# Altium schematic sheet Power-Supply.SchDoc: Power Supply
size A4; Revision: 1.0
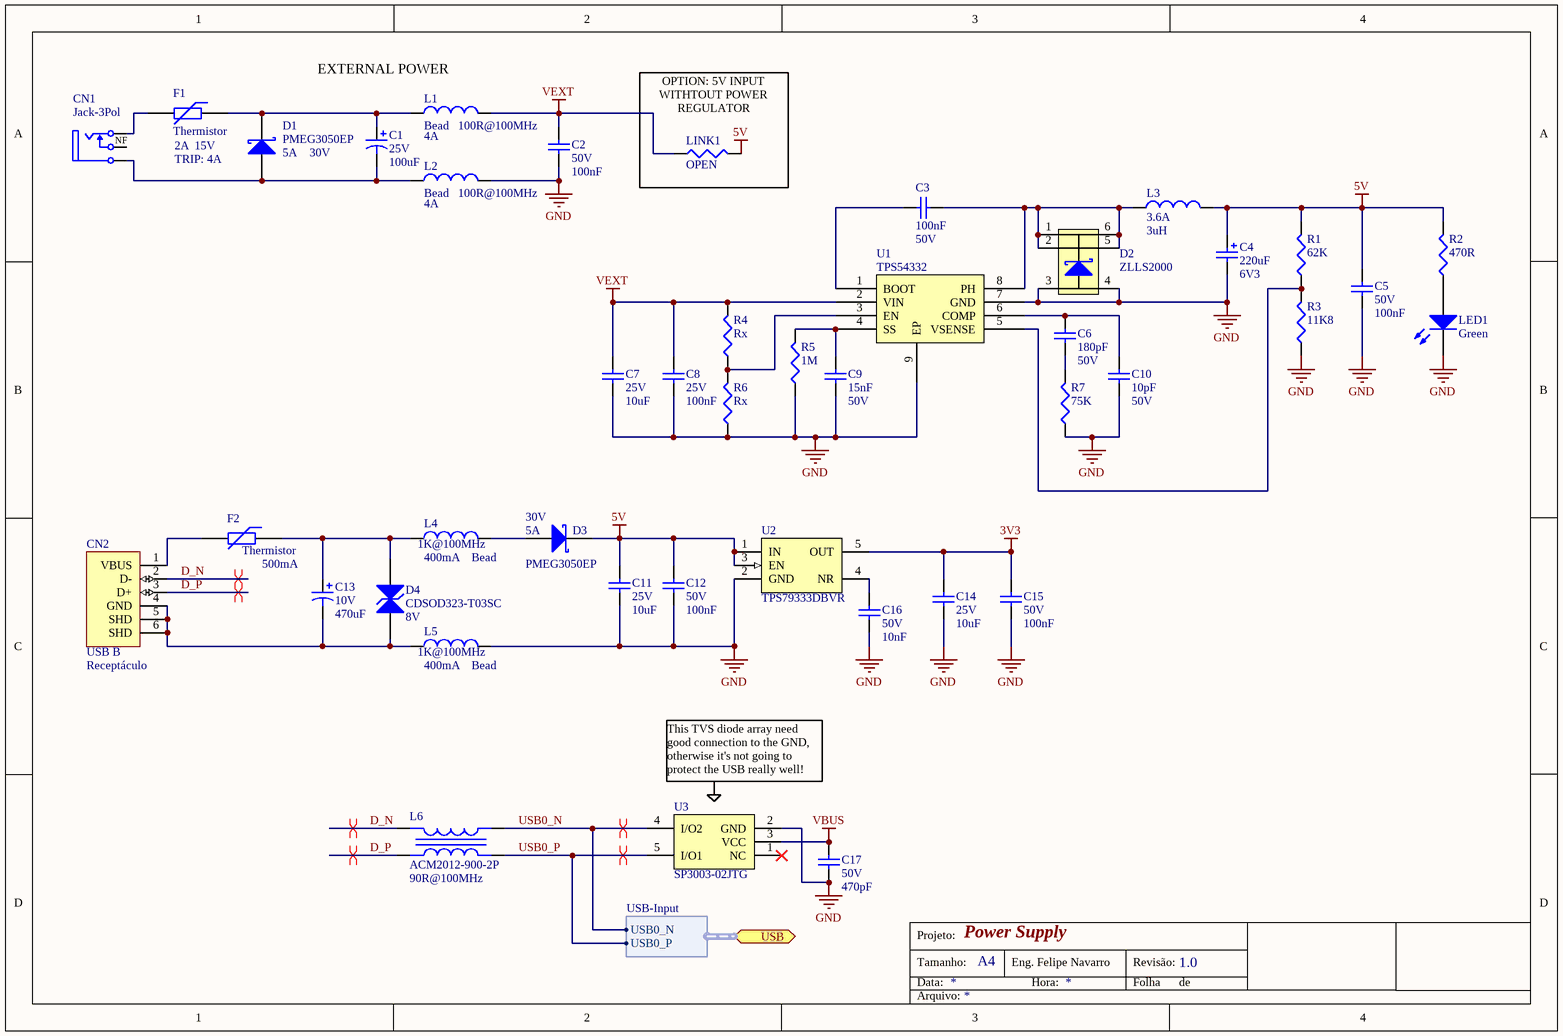
[diagram p0: Power-Supply.SchDoc]

## Parts
C1  value 100uF  Tensão: 25V  [CPOLRAD8X14]  (hidden comment: Capacitor Eletrolítico)
C2  value 100nF  Tensão: 50V  [CC0603]  (hidden comment: Capacitor Cerâmico)
C3  value 100nF  Tensão: 50V  [CC0603]  (hidden comment: Capacitor Cerâmico)
C4  value 220uF  Tensão: 6V3  [CPOL2917]  (hidden comment: Capacitor Tântalo)
C5  value 100nF  Tensão: 50V  [CC0603]  (hidden comment: Capacitor Cerâmico)
C6  value 180pF  Tensão: 50V  [CC0603]  (hidden comment: Capacitor Cerâmico)
C7  value 10uF  Tensão: 25V  [CC0805]  (hidden comment: Capacitor Cerâmico)
C8  value 100nF  Tensão: 25V  [CC0603]  (hidden comment: Capacitor Cerâmico)
C9  value 15nF  Tensão: 50V  [CC0603]  (hidden comment: Capacitor Cerâmico)
C10  value 10pF  Tensão: 50V  [CC0603]  (hidden comment: Capacitor Cerâmico)
C11  value 10uF  Tensão: 25V  [CC0805]  (hidden comment: Capacitor Cerâmico)
C12  value 100nF  Tensão: 50V  [CC0603]  (hidden comment: Capacitor Cerâmico)
C13  value 470uF  Tensão: 10V  [CPOLRAD6X12]  (hidden comment: Capacitor Eletrolítico)
C14  value 10uF  Tensão: 25V  [CC0805]  (hidden comment: Capacitor Cerâmico)
C15  value 100nF  Tensão: 50V  [CC0603]  (hidden comment: Capacitor Cerâmico)
C16  value 10nF  Tensão: 50V  [CC0603]  (hidden comment: Capacitor Cerâmico)
C17  value 470pF  Tensão: 50V  [CC0603]  (hidden comment: Capacitor Cerâmico)
CN1  Jack-3Pol  [CONN_JACK-FONTE_3N]
CN2  USB B  value Receptáculo  [CONN_USB-B_RCPT-H]
D1  PMEG3050EP  Corrente: 5A  Tensão: 30V  [SOD-128]
D2  ZLLS2000  [SOT-23-6N]
D3  PMEG3050EP  Corrente: 5A  Tensão: 30V  [SOD-128]
D4  CDSOD323-T03SC  Tensão: 8V  [SOD-323 BIDIRECT]
F1  Thermistor  Corrente: 2A  Tensão: 15V  Obs: TRIP: 4A  [CC1210]
F2  Thermistor  Corrente: 500mA  [CC1812]
L1  Bead  value 100R@100MHz  Corrente: 4A  [CC0805]
L2  Bead  value 100R@100MHz  Corrente: 4A  [CC0805]
L3  value 3uH  Corrente: 3.6A  [NR2424]  (hidden comment: Indutor)
L4  Bead  value 1K@100MHz  Corrente: 400mA  [CC0603]
L5  Bead  value 1K@100MHz  Corrente: 400mA  [CC0603]
L6  ACM2012-900-2P  value 90R@100MHz  [TR0805-4N]
LED1  value Green  [LED-INDIC]  (hidden comment: LED)
LINK1  value OPEN  [CC1210]  (hidden comment: Resistor Open)  (no BOM)
R1  value 62K  [CC0603]  (hidden comment: Resistor)
R2  value 470R  [CC0603]  (hidden comment: Resistor)
R3  value 11K8  [CC0603]  (hidden comment: Resistor)
R4  value Rx  [CC0603]  (hidden comment: Resistor)
R5  value 1M  [CC0603]  (hidden comment: Resistor)
R6  value Rx  [CC0603]  (hidden comment: Resistor)
R7  value 75K  [CC0603]  (hidden comment: Resistor)
U1  TPS54332  [SOIC-8N-EP]
U2  TPS79333DBVR  [SOT-23-5N]
U3  SP3003-02JTG  [SC70-5N]

## Ports
USB (harness USB-Input)

## Harnesses
USB-Input: USB0_N, USB0_P

## Nets
3V3: C14.2 C15.2 U2.5(OUT)
5V: C4.1 C5.2 C11.2 C12.2 D3.2(K) L3.2 LINK1.2 R1.2 R2.2 U2.1(IN) U2.3(EN)
GND: C2.1 C4.2 C5.1 C7.1 C8.1 C9.1 C10.1 C11.1 C12.1 C14.1 C15.1 C16.1 C17.1 D2.3(A) D2.4(A) L2.2 L5.2 LED1.2(K) R3.1 R5.1 R6.1 R7.1 U1.7(GND) U1.9(EP) U2.2(GND) U3.2(GND)
VBUS: C17.2 U3.3(VCC)
VEXT: C2.2 C7.2 C8.2 L1.2 LINK1.1 R4.2 U1.2(VIN)
D_N: CN2.2(D-) L6.1(Pri+)
D_P: CN2.3(D+) L6.2(Pri-)
USB0_N: L6.4(Sec-) U3.4(I/O2) ; port USB.USB0_N
USB0_P: L6.3(Sec+) U3.5(I/O1) ; port USB.USB0_P
NetC1_1: C1.1 D1.2(K) F1.1 L1.1
NetC1_2: C1.2 CN1.2(Malha) D1.1(A) L2.1
NetC3_1: C3.1 D2.1(C) D2.2(C) D2.5(C) D2.6(C) L3.1 U1.8(PH)
NetC3_2: C3.2 U1.1(BOOT)
NetC6_1: C6.1 R7.2
NetC6_2: C6.2 C10.2 U1.6(COMP)
NetC9_2: C9.2 R5.2 U1.4(SS)
NetC13_1: C13.1 D4.2(K) F2.1 L4.1
NetC13_2: C13.2 CN2.4(GND) CN2.5(SHD) CN2.6(SHD) D4.1(A) L5.1
NetC16_2: C16.2 U2.4(NR)
NetCN1_1: CN1.1(Centro) F1.2
NetCN2_1: CN2.1(VBUS) F2.2
NetD3_1: D3.1(A) L4.2
NetLED1_1: LED1.1(A) R2.1
NetR1_1: R1.1 R3.2 U1.5(VSENSE)
NetR4_1: R4.1 R6.2 U1.3(EN)

Not connected (* = marked no-connect by the designer): CN1 3(NF); U3 1(NC)*

## Layout directives
differential pair: D_N, D_P, USB0_N, USB0_P

## Notes on the sheet
- (near L1) EXTERNAL POWER
- (near LINK1) OPTION: 5V INPUT WITHTOUT POWER REGULATOR
- This TVS diode array need good connection to the GND, otherwise it's not going to protect the USB really well!
- Projeto:
- Tamanho:
- Data:
- A4
- Eng. Felipe Navarro
- Hora:
- Revisão:
- Folha
- de
- Arquivo:

## Library data of the parts
C1 = PCap 100uF 25V 8d.x14h.: Polarized Capacitor (Radial); ChinesePrice: 0,00000; Chinês: ----; Corrente: *A; Potência: *W; Obs: Alumínio; Tolerância: ±20%; Supplier 1: Digi-Key; Supplier Part Number 1: 493-4496-1-ND; ComponentLink1Description: Datasheet; ComponentLink1URL: D:\Tecnoclade\Datasheet\!DataMissing.pdf
C2 C5 C12 C15 = Cap 100nF 50V 0603 X7R: Capacitor (Semiconductor SIM Model); Chinês: Local; ChinesePrice: 0,00250; Corrente: *A; Potência: *W; Obs:: X7R; Tolerância: ±10%; Supplier 1: Digi-Key; Supplier Part Number 1: 1276-1000-1-ND; ComponentLink1Description: Datasheet; ComponentLink1URL: D:\Tecnoclade\Datasheet\!DataMissing.pdf
C3 = Cap 100nF 50V 0603 X7R: Capacitor (Semiconductor SIM Model); ChinesePrice: 0,00250; Chinês: Local; Corrente: *A; Potência: *W; Tolerância: ±10%; Obs:: X7R; Supplier 1: Digi-Key; Supplier Part Number 1: 1276-1000-1-ND; ComponentLink1Description: Datasheet; ComponentLink1URL: D:\Tecnoclade\Datasheet\!DataMissing.pdf
C4 = PCap 220uF 6V3 2917 LOESR: Polarized Capacitor; ChinesePrice: 0,28500; Chinês: Local; Corrente: 3.5A (Ripple); Potência: *W; Obs: LOESR (0R009); Tolerância: ±20%; Supplier 1: Digi-Key; Supplier Part Number 1: 1189-1687-1-ND; ComponentLink1Description: Datasheet; ComponentLink1URL: D:\Tecnoclade\Datasheet\!DataMissing.pdf
C6 = Cap 180pF 50V 0603 NP0: Capacitor (Semiconductor SIM Model); ChinesePrice: 0,00360; Chinês: Local; Corrente: *A; Potência: *W; Tolerância: ±5%; Obs:: NP0; Supplier 1: Digi-Key; Supplier Part Number 1: 1276-1255-1-ND; ComponentLink1Description: Datasheet; ComponentLink1URL: D:\Tecnoclade\Datasheet\!DataMissing.pdf
C7 C11 C14 = Cap 10uF 25V 0805 X5R: Capacitor (Semiconductor SIM Model); Chinês: Local; ChinesePrice: 0,02620; Corrente: *A; Potência: *W; Obs:: X5R; Tolerância: ±10%; Supplier 1: Digi-Key; Supplier Part Number 1: 587-2985-1-ND; ComponentLink1Description: Datasheet; ComponentLink1URL: D:\Tecnoclade\Datasheet\!DataMissing.pdf
C8 = Cap 100nF 25V 0603 X7R: Capacitor (Semiconductor SIM Model); Chinês: Local; ChinesePrice: 0,00246; Corrente: *A; Potência: *W; Obs:: X7R; Tolerância: ±10%; Supplier 1: Digi-Key; Supplier Part Number 1: 490-1524-1-ND; ComponentLink1Description: Datasheet; ComponentLink1URL: D:\Tecnoclade\Datasheet\!DataMissing.pdf
C9 = Cap 15nF 50V 0603 X7R: Capacitor (Semiconductor SIM Model); ChinesePrice: 0,00500; Chinês: Local; Corrente: *A; Potência: *W; Tolerância: ±10%; Obs:: X7R; Supplier 1: Digi-Key; Supplier Part Number 1: 445-5189-1-ND; ComponentLink1Description: Datasheet; ComponentLink1URL: D:\Tecnoclade\Datasheet\!DataMissing.pdf
C10 = Cap 10pF 50V 0603 NP0 5%: Capacitor (Semiconductor SIM Model); ChinesePrice: 0,00180; Chinês: Local; Corrente: *A; Potência: *W; Tolerância: ±5%; Obs:: NP0; Supplier 1: Digi-Key; Supplier Part Number 1: 445-1269-1-ND; ComponentLink1Description: Datasheet; ComponentLink1URL: D:\Tecnoclade\Datasheet\!DataMissing.pdf
C13 = PCap 470uF 10V 6d.x12h.: Polarized Capacitor (Radial); ChinesePrice: 0,00000; Chinês: ----; Corrente: *A; Potência: *W; Obs: ESH477M010AE3AA - Alumínio; Tolerância: ±20%; Supplier 1: Digi-Key; Supplier Part Number 1: 399-6589-ND; ComponentLink1Description: Datasheet; ComponentLink1URL: D:\Tecnoclade\Datasheet\!DataMissing.pdf
C16 = Cap 10nF 50V 0603 X7R 5%: Capacitor (Semiconductor SIM Model); Chinês: Local; ChinesePrice: 0,00320; Corrente: *A; Potência: *W; Obs:: X7R; Tolerância: ±5%; Supplier 1: Digi-Key; Supplier Part Number 1: 399-1092-1-ND; ComponentLink1Description: Datasheet; ComponentLink1URL: D:\Tecnoclade\Datasheet\!DataMissing.pdf
C17 = Cap 470pF 50V 0603 X7R: Capacitor (Semiconductor SIM Model); Chinês: Local; ChinesePrice: 0,00180; Corrente: *A; Potência: *W; Obs:: X7R; Tolerância: ±10%; Supplier 1: Digi-Key; Supplier Part Number 1: 399-1075-1-ND; ComponentLink1Description: Datasheet; ComponentLink1URL: D:\Tecnoclade\Datasheet\!DataMissing.pdf
CN1 = Jack-3Pol: Jack Socket, Thru-Hole, Vertical, 2 Conductors, 3 Contacts Single Switch, Normally Closed; ChinesePrice: 0,06600; Chinês: Local; Corrente: 5A; Tensão: 16VDC; Value: Receptáculo - 3Pol; Supplier 1: Digi-Key; Potência: *; Obs:: *; Tolerância: *; ComponentLink1Description: Datasheet; Supplier Part Number 1: CP-202BH-ND
CN2 = USB B RCPT-H: Conector Jack USB B, Through Hole, Right Angle, Horizontal; ChinesePrice: 0,00000; Chinês: ----; Obs:: USB 2.0; Corrente: *; Potência: *; Supplier 1: Digi-Key; Supplier Part Number 1: A31725-ND; Tensão: *; Tolerância: *; ComponentLink1Description: Datasheet; ComponentLink1URL: D:\Tecnoclade\Datasheet\!DataMissing.pdf
D1 D3 = DS 30V 5A SOD-128: Schottky Diode; ChinesePrice: 0,16100; Chinês: Local; Value: Vf=360mV @ 5A; Obs: Fast Recovery =< 500ns, > 200mA (Io); Supplier 1: Digi-Key; Supplier Part Number 1: 568-6753-1-ND; ComponentLink1Description: Datasheet; ComponentLink1URL: D:\Tecnoclade\Datasheet\!DataMissing.pdf
D2 = ZLLS2000: Power Shottky; Tensão: 40V; Corrente: 2.2A; ChinesePrice: 0,33990; Chinês: Local; Supplier 1: Digi-Key; Supplier Part Number 1: ZLLS2000CT-ND; Potência: *; Value: *; ComponentLink1Description: Datasheet; ComponentLink1URL: D:\Tecnoclade\Datasheet\!DataMissing.pdf; Tolerância: *; Obs:: *
D4 = TVS 8V 5% SOD323 BI 400W: Transient Voltage Supressor diode; ChinesePrice: 0,00000; Chinês: ----; Corrente: 43A; Potência: 400W; Value: 200pF@1MHz; Obs:: Bidirecional; Tolerância: ±*%; Supplier 1: Digi-Key; Supplier Part Number 1: CDSOD323-T03SCCT-ND; ComponentLink1Description: Datasheet; ComponentLink1URL: D:\Tecnoclade\Datasheet\!DataMissing.pdf
F1 = Res Varistor: Varistor (Voltage-Sensitive Resistor); ChinesePrice: 0,09500; Chinês: Local; Supplier 1: Digi-Key; Supplier Part Number 1: 507-1792-1-ND; ComponentLink1Description: Datasheet; ComponentLink1URL: D:\Tecnoclade\Datasheet\!DataMissing.pdf
F2 = Res Varistor: Varistor (Voltage-Sensitive Resistor); Tensão: 15V; ChinesePrice: 0,09500; Chinês: Local; Obs: TRIP: 1A; Supplier 1: Digi-Key; Supplier Part Number 1: 507-1762-1-ND; ComponentLink1Description: Datasheet; ComponentLink1URL: D:\Tecnoclade\Datasheet\!DataMissing.pdf
L1 L2 = Bd 180R@100MHz 1806 3A: ChinesePrice: 0,00000; Chinês: -----; Obs:: Ferrite (0R025); Tolerância: ±*%; Potência: *; Supplier 1: Digi-Key; Supplier Part Number 1: 445-1567-1-ND; Tensão: *; ComponentLink1Description: Datasheet; ComponentLink1URL: D:\Tecnoclade\Datasheet\!DataMissing.pdf
L3 = Ind 3uH 2424 3.6A: Inductor; ChinesePrice: 0,00000; Chinês: ----; Obs:: (0R023)@100MHz; Tolerância: ±30%; Potência: *; Supplier 1: Digi-Key; Supplier Part Number 1: 587-2099-1-ND; Tensão: *; ComponentLink1Description: Datasheet; ComponentLink1URL: D:\Tecnoclade\Datasheet\!DataMissing.pdf
L4 L5 = Bd 1K@100MHz 0603 400mA: ChinesePrice: 0,00000; Chinês: -----; Obs:: Ferrite (0R5); Tolerância: ±25%; Potência: *; Supplier 1: Digi-Key; Supplier Part Number 1: 445-1550-1-ND; Tensão: *; ComponentLink1Description: Datasheet; ComponentLink1URL: D:\Tecnoclade\Datasheet\!DataMissing.pdf; Substituição: 27/06/2014
L6 = ACM2012-900-2P: Indutor de Modo Comum; Corrente: 400mA; ChinesePrice: 0,19100; Chinês: Local; Potência: *W; Tensão: *V; Tolerância: ±*%; Obs:: Z=0R19; Supplier Part Number 1: 445-2207-1-ND; Supplier 1: Digi-Key; ComponentLink1Description: Datasheet; ComponentLink1URL: D:\Tecnoclade\Datasheet\!DataMissing.pdf; Substituição: 00/00/0000
LED1 = LED2: Typical RED, GREEN, YELLOW, AMBER GaAs LED; ChinesePrice: 0,00000; Chinês: ----; VertSimCode: } XXXXX {; Supplier 1: Digi-Key; Supplier Part Number 1: 754-1297-ND
LINK1 = Res Open 0603: Resistor; ChinesePrice: 0,00000; Chinês: ----; Corrente: *A; Potência: *W; Tensão: *V; Tolerância: ±*%; Supplier 1: Digi-Key; Supplier Part Number 1: --Del; Obs:: *; ComponentLink1Description: Datasheet; ComponentLink1URL: D:\Tecnoclade\Datasheet\!DataMissing.pdf
R1 = Res 62K 1% 0603 1/10W: Potência: 1/10W; ChinesePrice: 0,00089; Chinês: Local; Corrente: *A; Tensão: *V; Tolerância: ±1%; Supplier 1: Digi-Key; Supplier Part Number 1: 311-62.0KHRCT-ND; ComponentLink1Description: Datasheet; ComponentLink1URL: D:\Tecnoclade\Datasheet\!DataMissing.pdf; Obs: *
R2 = Res 470R 5% 0603 1/10W: ChinesePrice: 0,00000; Chinês: ----; Corrente: *A; Potência: 1/10W; Tensão: *V; Obs: ±200ppm/ºC; Tolerância: ±5%; Supplier 1: Digi-Key; Supplier Part Number 1: RMCF0603JT470RCT-ND; ComponentLink1Description: Datasheet; ComponentLink1URL: D:\Tecnoclade\Datasheet\!DataMissing.pdf
R3 = Res 11K8 1% 0603 1/10W: Potência: 1/10W; ChinesePrice: 0,00089; Chinês: Local; Corrente: *A; Tensão: *V; Tolerância: ±1%; Supplier 1: Digi-Key; Supplier Part Number 1: 311-11.8KHRCT-ND; ComponentLink1Description: Datasheet; ComponentLink1URL: D:\Tecnoclade\Datasheet\!DataMissing.pdf; Obs: *
R4 = Res 150K 1% 0603 1/10W: Potência: 1/10W; ChinesePrice: 0,00089; Chinês: Local; Corrente: *A; Tensão: *V; Tolerância: ±1%; Supplier 1: Digi-Key; Supplier Part Number 1: P150KHCT-ND; ComponentLink1Description: Datasheet; ComponentLink1URL: D:\Tecnoclade\Datasheet\!DataMissing.pdf; Obs: *
R5 = Res 1M 1% 0603 1/10W: Potência: 1/10W; ChinesePrice: 0,00089; Chinês: Local; Corrente: *A; Tensão: *V; Obs: ±100ppm/ºC; Tolerância: ±1%; Supplier 1: Digi-Key; Supplier Part Number 1: RMCF0603FT1M00CT-ND; ComponentLink1Description: Datasheet; ComponentLink1URL: D:\Tecnoclade\Datasheet\!DataMissing.pdf
R6 = Res 48K7 1% 0603 1/10W: Potência: 1/10W; ChinesePrice: 0,00089; Chinês: Local; Corrente: *A; Tensão: *V; Tolerância: ±1%; Supplier 1: Digi-Key; Supplier Part Number 1: P48.7KHCT-ND; ComponentLink1Description: Datasheet; ComponentLink1URL: D:\Tecnoclade\Datasheet\!DataMissing.pdf; Obs: *
R7 = Res 75K 1% 0603 1/10W: Potência: 1/10W; ChinesePrice: 0,00100; Chinês: Local; Corrente: *A; Tensão: *V; Obs: ±100ppm/ºC; Tolerância: ±1%; Supplier 1: Digi-Key; Supplier Part Number 1: P75.0KHCT-ND; ComponentLink1Description: Datasheet; ComponentLink1URL: D:\Tecnoclade\Datasheet\!DataMissing.pdf
U1 = TPS54332: DC/DC Converter Step-Down 3.5A 28V; ChinesePrice: 0,87200; Chinês: TI; Corrente: 3.5A; Supplier 1: Digi-Key; Supplier Part Number 1: 296-24141-5-ND; ComponentLink1Description: Datasheet; ComponentLink1URL: D:\Tecnoclade\Datasheet\!DataMissing.pdf
U2 = TPS79333: ULTRALOW-NOISE, HIGH PSRR, FAST RF 200mA LOW-DROPOUT LINEAR  REGULATORS I; Tensão: 3V3; ChinesePrice: 0,00000; Chinês: ----; Corrente: 200mA; Potência: *; Supplier 1: Digi-Key; Supplier Part Number 1: 296-12961-1-ND; Value: *; Obs:: *; Tolerância: *; ComponentLink1Description: Datasheet; ComponentLink1URL: D:\Tecnoclade\Datasheet\
U3 = SP3003-02JTG: TVS DIODE ARRAY; Value: 0.65pF; Tensão: 6V; Supplier Part Number 1: F3301CT-ND; Supplier 1: Digi-Key